# Altium schematic sheet NANDFlash.SchDoc
size A4
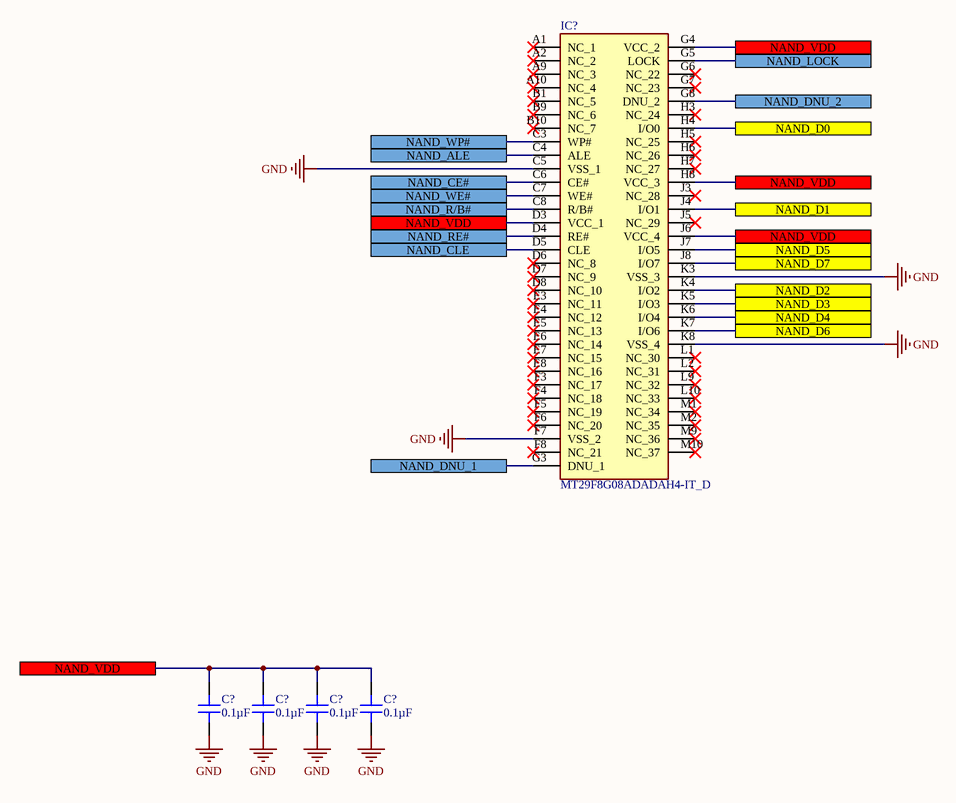
[diagram p0: NANDFlash.SchDoc]

## Parts
(Parts that share a designator on the sheet are numbered #1, #2 ... from top to bottom, then left to right.)
C?#1  0.1µF  [CAP 0402_1005]
C?#2  0.1µF  [CAP 0402_1005]
C?#3  0.1µF  [CAP 0402_1005]
C?#4  0.1µF  [CAP 0402_1005]
IC?  MT29F8G08ADADAH4-IT_D  [BGA63C80P10X12_900X1100X100]

## Ports
NAND_ALE, NAND_CE#, NAND_CLE, NAND_D0, NAND_D1, NAND_D2, NAND_D3, NAND_D4, NAND_D5, NAND_D6, NAND_D7, NAND_DNU_1, NAND_DNU_2, NAND_LOCK, NAND_R/B#, NAND_RE#, NAND_VDD, NAND_WE#, NAND_WP#

## Nets
GND: C?#1.1 C?#2.1 C?#3.1 C?#4.1 IC?.C5(VSS_1) IC?.F7(VSS_2) IC?.K3(VSS_3) IC?.K8(VSS_4)
NAND_ALE: IC?.C4(ALE) ; port NAND_ALE
NAND_CE#: IC?.C6(CE#) ; port NAND_CE#
NAND_CLE: IC?.D5(CLE) ; port NAND_CLE
NAND_D0: IC?.H4(I/O0) ; port NAND_D0
NAND_D1: IC?.J4(I/O1) ; port NAND_D1
NAND_D2: IC?.K4(I/O2) ; port NAND_D2
NAND_D3: IC?.K5(I/O3) ; port NAND_D3
NAND_D4: IC?.K6(I/O4) ; port NAND_D4
NAND_D5: IC?.J7(I/O5) ; port NAND_D5
NAND_D6: IC?.K7(I/O6) ; port NAND_D6
NAND_D7: IC?.J8(I/O7) ; port NAND_D7
NAND_DNU_1: IC?.G3(DNU_1) ; port NAND_DNU_1
NAND_DNU_2: IC?.G8(DNU_2) ; port NAND_DNU_2
NAND_LOCK: IC?.G5(LOCK) ; port NAND_LOCK
NAND_R/B#: IC?.C8(R/B#) ; port NAND_R/B#
NAND_RE#: IC?.D4(RE#) ; port NAND_RE#
NAND_VDD: C?#1.2 C?#2.2 C?#3.2 C?#4.2 IC?.D3(VCC_1) IC?.G4(VCC_2) IC?.H8(VCC_3) IC?.J6(VCC_4) ; port NAND_VDD
NAND_WE#: IC?.C7(WE#) ; port NAND_WE#
NAND_WP#: IC?.C3(WP#) ; port NAND_WP#

Not connected (* = marked no-connect by the designer): IC? A1(NC_1)* A2(NC_2)* A9(NC_3)* A10(NC_4)* B1(NC_5)* B9(NC_6)* B10(NC_7)* D6(NC_8)* D7(NC_9)* D8(NC_10)* E3(NC_11)* E4(NC_12)* E5(NC_13)* E6(NC_14)* E7(NC_15)* E8(NC_16)* F3(NC_17)* F4(NC_18)* F5(NC_19)* F6(NC_20)* F8(NC_21)* G6(NC_22)* G7(NC_23)* H3(NC_24)* H5(NC_25)* H6(NC_26)* H7(NC_27)* J3(NC_28)* J5(NC_29)* L1(NC_30)* L2(NC_31)* L9(NC_32)* L10(NC_33)* M1(NC_34)* M2(NC_35)* M9(NC_36)* M10(NC_37)*

## Library data of the parts
C?#1-C?#4 = 0402ZD104KAT2A: CAP CER 0.1UF 10V X5R 0402; Manufacturer: AVX Corporation; Tolerance: ±10%; Part Number: 0402ZD104KAT2A; Value: 0.1µF; Applications: General Purpose; Capacitance: 0.1µF; ComponentLink1Description: Datasheet; ComponentLink1URL: http://datasheets.avx.com/cx5r.pdf; ComponentLink2Description: DigiKey Link; ComponentLink2URL: http://digikey.com/product-detail/en/avx-corporation/0402ZD104KAT2A/478-1129-1-ND/564161; Device Package: 0402 (1005 Metric); LastUpdated: 2/9/2020 1:01:39; Lifecycle Status: Active; Minimum Order: 1; Mounting Type: Surface Mount, MLCC; Operating Temperature: -55°C ~ 85°C; Package / Case: 0402 (1005 Metric); Packaging: TapeAndReel; PartId: 12555; Part Status: Active; Price: 0.01; Series: -; Size / Dimension: 0.039" L x 0.020" W (1.00mm x 0.50mm); Supplier 1: DigiKey; Supplier Part Number 1: 478-1129-1-ND; Temperature Coefficient: X5R; Thickness (Max): 0.022" (0.56mm); Voltage - Rated: 10V
IC? = MT29F8G08ADADAH4-IT_D: Integrated Circuit; Manufacturer_Name: Micron; Manufacturer_Part_Number: MT29F8G08ADADAH4-IT:D; Datasheet Link: https://www.mouser.co.uk/datasheet/2/671/micron_technology_micts06228-1-1759217.pdf; Height: 1mm; Mouser Part Number: 340-112428-TRAY; Mouser Price/Stock: https://www.mouser.co.uk/ProductDetail/Micron/MT29F8G08ADADAH4-ITD/?qs=rrS6PyfT74eZPKUjEpJhBg%3D%3D; Arrow Part Number: MT29F8G08ADADAH4-IT:D; Arrow Price/Stock: https://www.arrow.com/en/products/mt29f8g08adadah4-itd/micron-technology